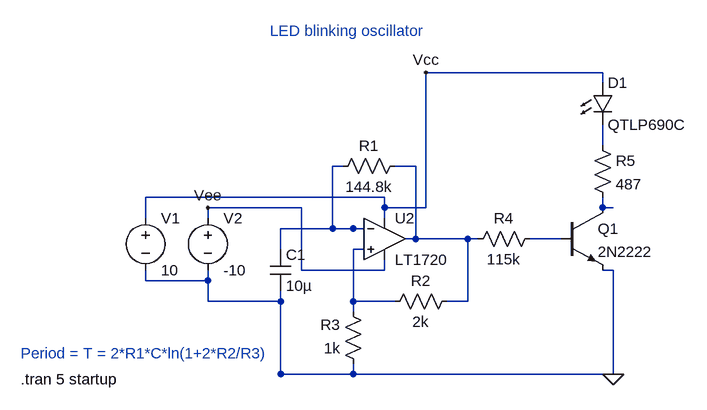
[diagram p0: schematic LED-blinking-oscillator.asc]
LED-blinking-oscillator.asc, the LTspice schematic file:
Version 4.1
SHEET 1 880 680
WIRE -32 208 -32 224
WIRE 464 176 480 176
WIRE 80 320 80 336
WIRE -240 176 -240 192
WIRE -144 176 -144 192
WIRE -32 224 -144 224
WIRE -144 224 -144 192
WIRE -144 192 -240 192
WIRE -32 224 -32 336
WIRE -32 336 80 336
WIRE -32 336 480 336
WIRE 480 336 480 176
FLAG 480 336 0
WIRE 464 -48 464 -32
WIRE 464 -16 464 -32
WIRE -32 144 -32 128
WIRE 64 16 48 16
WIRE 96 112 80 112
WIRE -32 128 -32 112
WIRE -32 112 80 112
WIRE 80 112 48 112
WIRE 48 112 48 16
WIRE 144 16 160 16
WIRE 224 224 240 224
WIRE 272 128 256 128
WIRE 160 128 176 128
WIRE 160 16 176 16
WIRE 176 16 176 128
WIRE 176 128 256 128
WIRE 256 128 256 224
WIRE 256 224 240 224
WIRE 464 80 480 80
WIRE 464 64 464 80
WIRE 400 128 384 128
WIRE 352 128 368 128
WIRE 384 128 368 128
WIRE 144 224 128 224
WIRE 80 240 80 224
WIRE 96 144 80 144
WIRE 128 224 80 224
WIRE 80 224 80 144
WIRE 464 -112 464 -128
WIRE 128 96 128 80
WIRE -240 96 -240 80
WIRE 464 -128 192 -128
WIRE 192 -128 192 80
WIRE 192 80 128 80
WIRE 128 80 128 64
WIRE 128 64 -240 64
WIRE -240 64 -240 80
FLAG 192 -128 Vcc
WIRE 128 160 128 176
WIRE -144 96 -144 80
WIRE 128 176 0 176
WIRE 0 176 0 80
WIRE 0 80 -144 80
FLAG -144 80 Vee
SYMBOL cap -48 144 R0
SYMATTR InstName C1
SYMATTR Value 10µ
SYMBOL res 160 0 R90
WINDOW 0 0 56 VBottom 2
WINDOW 3 32 56 VTop 2
SYMATTR InstName R1
SYMATTR Value 144.8k
SYMBOL res 240 208 R90
WINDOW 0 0 56 VBottom 2
WINDOW 3 32 56 VTop 2
SYMATTR InstName R2
SYMATTR Value 2k
SYMBOL res 96 336 R180
WINDOW 0 36 76 Left 2
WINDOW 3 36 40 Left 2
SYMATTR InstName R3
SYMATTR Value 1k
SYMBOL voltage -240 80 R0
WINDOW 123 0 0 Left 2
WINDOW 39 0 0 Left 2
SYMATTR InstName V1
SYMATTR Value 10
SYMBOL res 368 112 R90
WINDOW 0 0 56 VBottom 2
WINDOW 3 32 56 VTop 2
SYMATTR InstName R4
SYMATTR Value 115k
SYMBOL npn 400 80 R0
SYMATTR InstName Q1
SYMATTR Value 2N2222
SYMBOL res 448 -32 R0
SYMATTR InstName R5
SYMATTR Value 487
SYMBOL LED 448 -112 R0
SYMATTR InstName D1
SYMATTR Value QTLP690C
SYMBOL voltage -144 80 R0
WINDOW 123 0 0 Left 2
WINDOW 39 0 0 Left 2
SYMATTR InstName V2
SYMATTR Value -10
SYMBOL Comparators\\LT1720 128 64 R0
SYMATTR InstName U2
TEXT -432 344 Left 2 !.tran 5 startup
TEXT -432 304 Left 2 ;Period = T = 2*R1*C*ln(1+2*R2/R3)
TEXT -48 -192 Left 2 ;LED blinking oscillator

The netlist it stands for:
* LED-blinking-oscillator.asc
C1 N002 0 10µ
R1 N003 N002 144.8k
R2 N003 N006 2k
R3 0 N006 1k
V1 Vcc 0 10
R4 N005 N003 115k
Q1 N004 N005 0 0 2N2222
R5 N001 N004 487
D1 Vcc N001 QTLP690C
V2 Vee 0 -10
X§U2 N006 N002 Vcc Vee N003 LT1720  ; pins In+ In- V+ V- OUT
.model D D
.lib standard.dio
.model NPN NPN
.model PNP PNP
.lib standard.bjt
.tran 5 startup
* Period = T = 2*R1*C*ln(1+2*R2/R3)
* LED blinking oscillator
.lib LT1720.sub
.backanno
.end